# EAGLE schematic BBUNO (EAGLE 9.6.2)
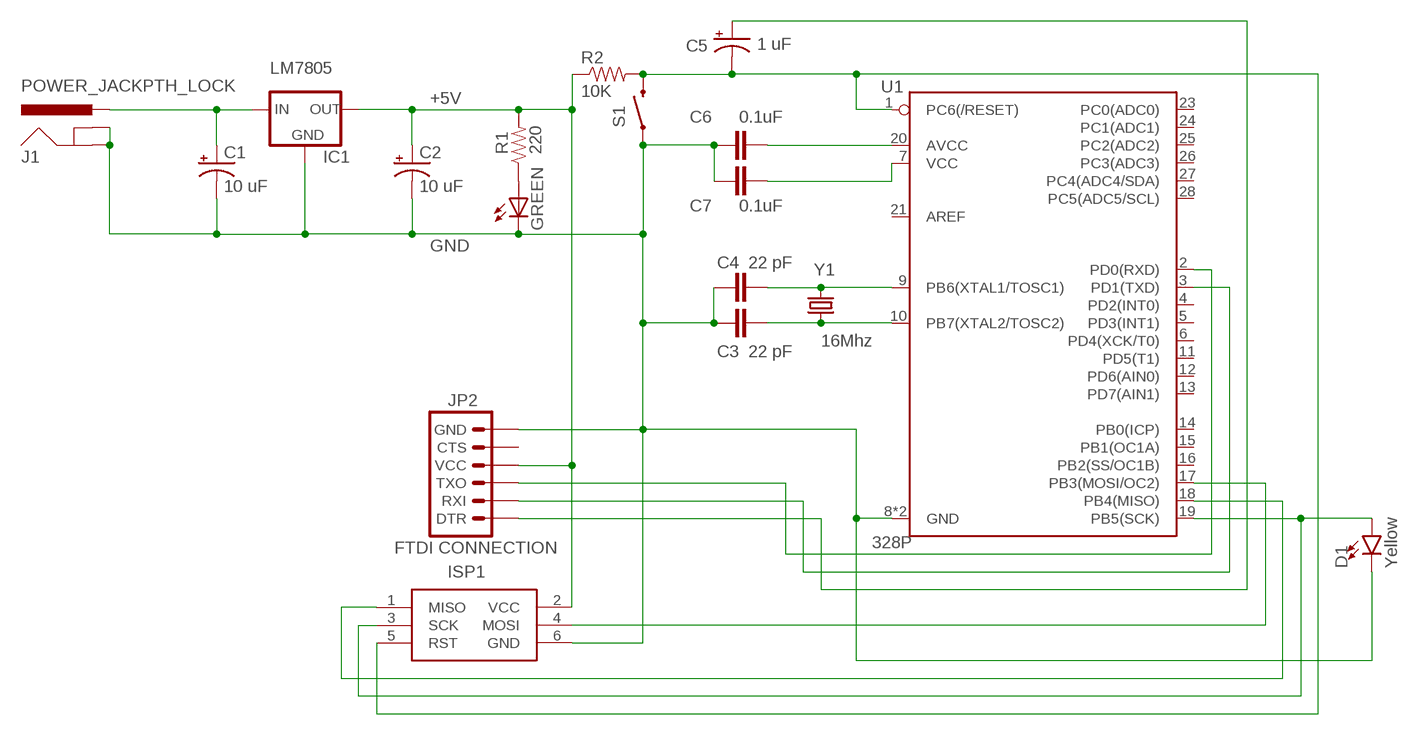
[diagram p0: schematic, sheet 1]

## Parts
C1  10 uF  CAP_POLSMD  [VISHAY_C]
C2  10 uF  CAP_POLSMD  [VISHAY_C]
C3  22 pF  CAPPTH1  [CAP-PTH-5MM]
C4  22 pF  CAPPTH1  [CAP-PTH-5MM]
C5  1 uF  CAP_POLPTH1  [CPOL-RADIAL-100UF-25V]
C6  0.1uF  0.1UF-0603-50V-10%-X7R-WE  [0603]
C7  0.1uF  0.1UF-0603-50V-10%-X7R-WE  [0603]
D1  Yellow  LED-YELLOW0603  [LED-0603]
GREEN  LED3MM  [LED3MM]
IC1  LM7805  V_REG_78XX-TO-220  [TO-220-ALT]
ISP1  ADAFRUIT_AVRISP-BOX  [ADAFRUIT_AVRISP-BOX]
J1  POWER_JACKPTH_LOCK  [POWER_JACK_PTH_LOCK]
JP2  FTDI CONNECTION  ARDUINO_SERIAL_PROGRAMPTH  [1X06]
R1  220  RESISTORPTH-1/4W  [AXIAL-0.4]
R2  10K  RESISTORPTH-1/4W  [AXIAL-0.4]
S1  SWITCH-MOMENTARY-2PTH  [TACTILE-PTH]
U1  328P  ATMEGA328P_PDIP  [DIP28]
Y1  16Mhz  CRYSTALHC49US  [HC49US]

## Nets
+5V: C2.+ IC1.OUT ISP1.2(VCC) JP2.4(VCC) R1.P$2 R2.P$1
GND: C1.- C2.- C3.2 C4.2 C6.1 C7.1 D1.C GREEN.K(C) IC1.GND ISP1.6(GND) J1.GND J1.GNDBREAK JP2.6(GND) S1.1 U1.8(GND) U1.22(GND)
N$1: C1.+ IC1.IN J1.PWR
N$2: C6.2 U1.20(AVCC)
N$3: JP2.3(TXO) U1.2(PD0(RXD))
N$4: GREEN.A R1.P$1
N$5: C4.1 U1.9(PB6(XTAL1/TOSC1)) Y1.2
N$6: C3.1 U1.10(PB7(XTAL2/TOSC2)) Y1.1
N$7: JP2.2(RXI) U1.3(PD1(TXD))
N$8: C5.1(+) JP2.1(DTR)
N$9: ISP1.1(MISO) U1.18(PB4(MISO))
N$10: ISP1.4(MOSI) U1.17(PB3(MOSI/OC2))
N$11: D1.A ISP1.3(SCK) U1.19(PB5(SCK))
N$12: C5.2(-) ISP1.5(RST) R2.P$2 S1.3 U1.1(PC6(/RESET))
N$15: C7.2 U1.7(VCC)
Unconnected: JP2.5(CTS) U1.4(PD2(INT0)) U1.5(PD3(INT1)) U1.6(PD4(XCK/T0)) U1.11(PD5(T1)) U1.12(PD6(AIN0)) U1.13(PD7(AIN1)) U1.14(PB0(ICP)) U1.15(PB1(OC1A)) U1.16(PB2(SS/OC1B)) U1.21(AREF) U1.23(PC0(ADC0)) U1.24(PC1(ADC1)) U1.25(PC2(ADC2)) U1.26(PC3(ADC3)) U1.27(PC4(ADC4/SDA)) U1.28(PC5(ADC5/SCL))

## Library data of the parts
C1 C2 C5 = SparkFun:CAP_POL: Capacitor Polarized These are standard SMD and PTH capacitors. Normally 10uF, 47uF, and 100uF in electrolytic and tantalum varieties. Always verify the external diameter of the through hole cap, it varies with capacity, voltage, and manufacturer. The EIA devices should be standard.
C3 C4 = SparkFun:CAP: Capacitor Standard 0603 ceramic capacitor, and 0.1" leaded capacitor.
C6 C7 = SparkFun-Capacitors:0.1UF: 0.1µF ceramic capacitors A capacitor is a passive two-terminal electrical component used to store electrical energy temporarily in an electric field.; PROD_ID: CAP-16523
D1 = SparkFun-LED:LED-YELLOW: Yellow SMD LED Used in manufacturing several products at SparkFun. Packages: 0603 - SMD 0603 package[Product Link] <http://www.kingbrightusa.com/product.asp?catalog_name=LED&product_id=APT1608SYCK> 0603 -SMART - SMART SMD 0603 package (more efficient/more expensive) [Product Link] <http://www.osram-os.com/osram_os/en/products/product-catalog/led-light-emitting-diodes/smartled-0603/ly-l29k/index.jsp> LilyPad - SMD1206 package[Product Datasheet] <https://www.sparkfun.com/datasheets/DevTools/LilyPad/Q150YUS4.pdf> SparkFun Products: Blynk Board <https://www.sparkfun.com/products/13794> IOIO-OTG <https://www.sparkfun.com/products/13613> XBee Explorer Serial <https://www.sparkfun.com/products/13225>; PROD_ID: DIO-09003
GREEN = SparkFun:LED: LEDs Standard schematic elements and footprints for 5mm, 3mm, 1206, and 0603 sized LEDs. 5mm - Spark Fun Electronics SKU : COM-00529 (and others)
IC1 = SparkFun:V_REG_78XX: Voltage Regulator Standard 7805 5V regulator. IGO (Input Ground Output). Spark Fun Electronics SKU : COM-00107
ISP1 = Adafruit 6-ISP AVR:ADAFRUIT_AVRISP: AVR ISP HEADER Standard 6 pin header for AVR programming
J1 = SparkFun-Connectors:POWER_JACK: Power Jack Connector This is the standard 5.5mm barrel jack for power. The PTH is the most common, proven, reliable, footprint. The Slot footprint only works if the mill layer is transmitted to the PCB fab house so be warned. Here are the connectors we sell at SparkFun: DC Barrel Power Jack/Connector <https://www.sparkfun.com/products/119> (PRT-00119) DC Barrel Power Jack/Connector (SMD) <https://www.sparkfun.com/products/12748> (PRT-12748) DC Barrel Jack Adapter - Breadboard Compatible <https://www.sparkfun.com/products/10811> (PRT-10811) It is used on this SparkFun product (and many, many others): SparkFun RedBoard - Programmed with Arduino <https://www.sparkfun.com/products/12757> (DEV-12757) Also, if you need a mating power supply or connector, please check these out: Wall Adapter Power Supply - 9VDC 650mA <https://www.sparkfun.com/products/298> (TOL-00298) DC Barrel Jack Adapter - Male <https://www.sparkfun.com/products/10287> (PRT-10287); PROD_ID: CONN-08197; SF_ID: PRT-00119
JP2 = SparkFun:ARDUINO_SERIAL_PROGRAM
R1 R2 = SparkFun:RESISTOR: Resistor Basic schematic elements and footprints for 0603, 1206, and PTH resistors.
S1 = SparkFun:SWITCH-MOMENTARY-2
U1 = SparkFun-IC-Microcontroller:ATMEGA328P_PDIP: Atmel 328P Through hole ATMEGA328P uC used in the Arduino 32kb flash, 1k EEPROM, 2k SRAM Datasheet <http://www.sparkfun.com/datasheets/Components/SMD/ATMega328.pdf> SparkFun Products Storefront component: AVR 28 Pin 20MHz 32K 6A/D - ATMega328P <https://www.sparkfun.com/products/9061> (COM-09061) SparkFun Simon Says - Through-Hole Soldering Kit <https://www.sparkfun.com/products/10547> (KIT-10547) SparkFun Learn to Solder - Simon Says <https://www.sparkfun.com/products/13708> (KIT-13708) SparkFun BigTime Watch Kit <https://www.sparkfun.com/products/11734> (KIT-11734) SparkFun ClockIt <https://www.sparkfun.com/products/10930> (KIT-10930) SparkFun Serial Enabled LCD Kit <https://www.sparkfun.com/products/10097> (LCD-10097) SparkFun Simon Tilts - Through Hole Soldering Kit <https://www.sparkfun.com/products/12634> (KIT-12634) SparkFun Frequency Counter Kit <https://www.sparkfun.com/products/10140> (KIT-10140) FabFM Radio Kit <https://www.sparkfun.com/products/11043> (KIT-11043) SparkFun Binary Blaster Kit <https://www.sparkfun.com/products/12037> (KIT-12037) SparkFun Metro-Gnome <https://www.sparkfun.com/products/9236> (KIT-09236) ATmega328 with Arduino Optiboot (Uno) <https://www.sparkfun.com/products/10524> (DEV-10524); PROD_ID: IC-09136
Y1 = SparkFun:CRYSTAL: Crystals Various standard crystals. Proven footprints. Spark Fun Electronics SKU : COM-00534